# EAGLE design cart_socket (EAGLE 5.06)
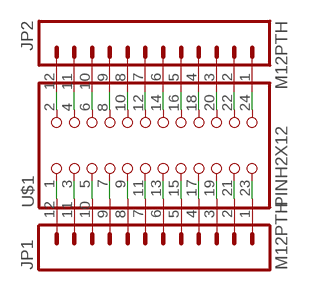
[diagram p0: schematic, sheet 1]

## Parts
JP1  M12PTH  [1X12]
JP2  M12PTH  [1X12]
U$1  PINH2X12  [2X12]

## Nets
N$1: JP1.12 U$1.1
N$2: JP1.11 U$1.3
N$3: JP1.10 U$1.5
N$4: JP1.9 U$1.7
N$5: JP1.8 U$1.9
N$6: JP1.7 U$1.11
N$7: JP1.6 U$1.13
N$8: JP1.5 U$1.15
N$9: JP1.4 U$1.17
N$12: JP1.3 U$1.19
N$14: JP1.2 U$1.21
N$15: JP1.1 U$1.23
N$16: JP2.12 U$1.2
N$17: JP2.11 U$1.4
N$18: JP2.10 U$1.6
N$19: JP2.9 U$1.8
N$20: JP2.8 U$1.10
N$21: JP2.7 U$1.12
N$22: JP2.6 U$1.14
N$23: JP2.5 U$1.16
N$24: JP2.4 U$1.18
N$25: JP2.3 U$1.20
N$26: JP2.2 U$1.22
N$27: JP2.1 U$1.24

## Library data of the parts
JP1 JP2 = SparkFun:M12: Header 12 Standard 12-pin 0.1" header. Use with straight break away headers (SKU : PRT-00116), right angle break away headers (PRT-00553), swiss pins (PRT-00743), machine pins (PRT-00117), and female headers (PRT-00115).
U$1 = SparkFun:PINH2X12

## Board
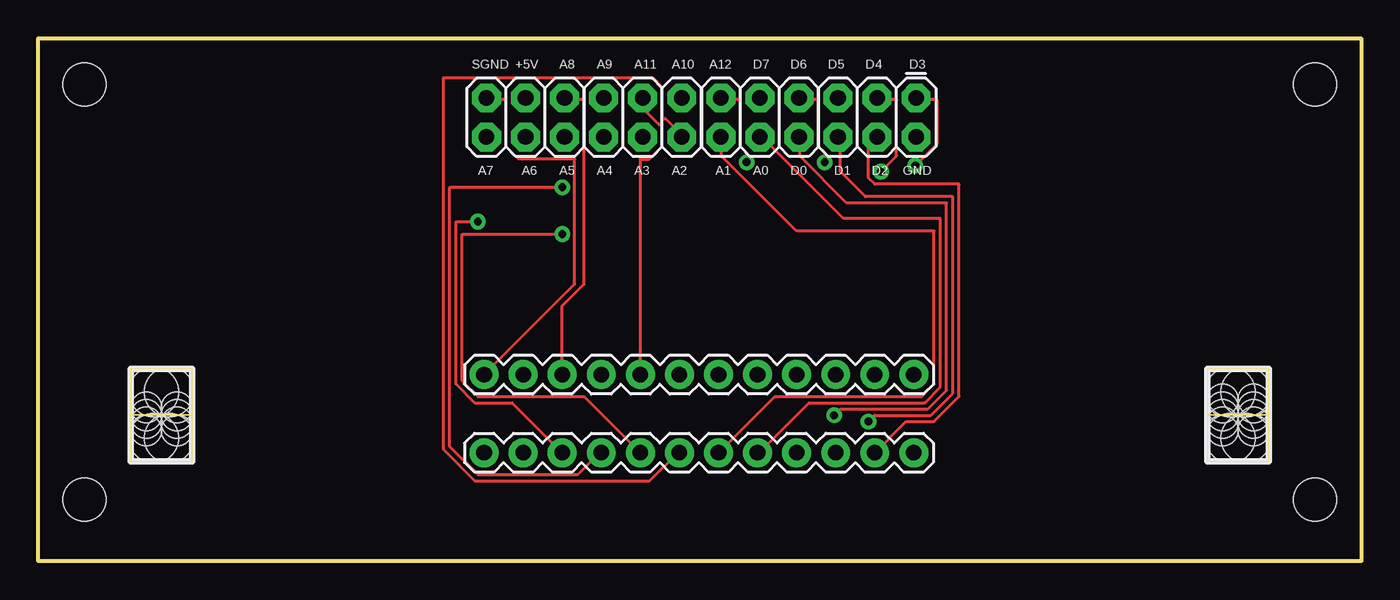
[diagram p1: board, top side]
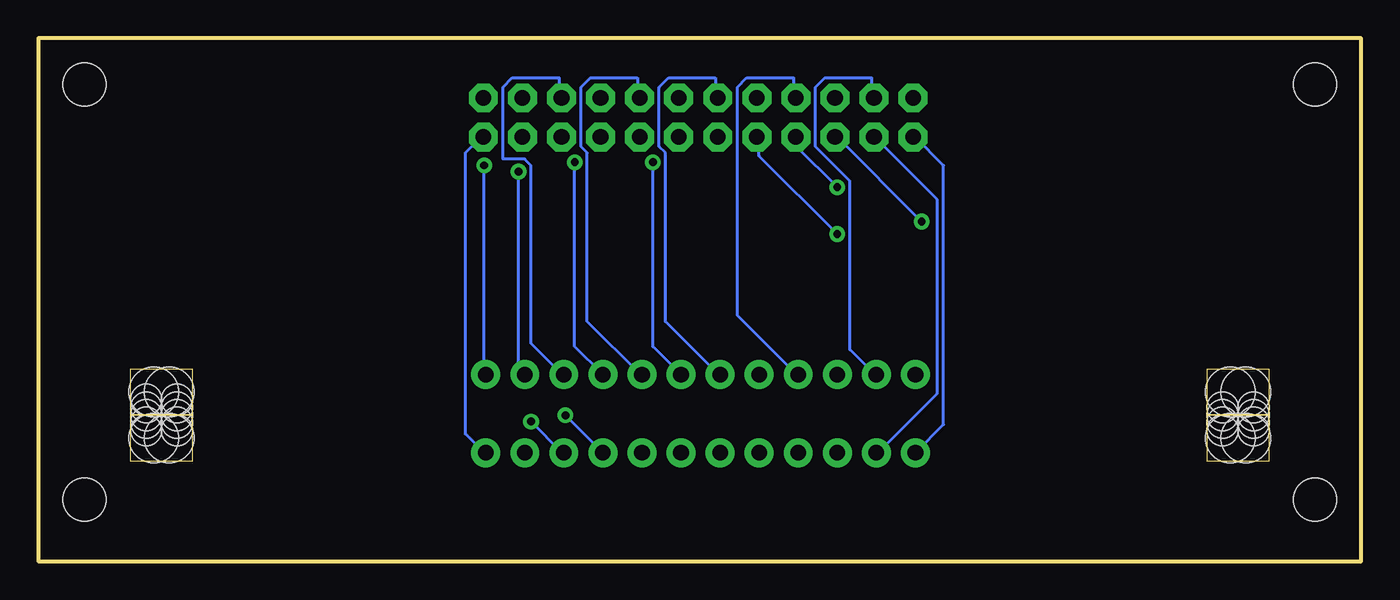
[diagram p2: board, bottom side, seen from below]

Size 86 x 34 mm. Coordinates in mm from the lower left corner, seen from the top.
Outline: 0,0 0,34 86,34 86,0 0,0
Copper layers (1*16): Top 0.035mm / dielectric 1.5mm / Bottom 0.035mm
Design rules "SparkFun": minimum track width 8mil, minimum drill 20mil, track to track 8mil, track to pad 8mil, pad to pad 8mil, via to via 8mil, smd to smd 8mil, copper to edge 10mil, drill to drill 8mil, minimum pad ring 12mil, minimum via ring 10mil, stop-mask expansion 4mil, vias tented up to drill 25mil, thermal gap 10mil
Holes 3.2 mm at 7.5,11 7.5,8 78.5,11 78.5,8 77.5,8 77.5,11 8.5,11 8.5,8
Holes 2 mm at 7,10 7,9 7,8.5 7,9.5 9,10 9,9.5 9,9 9,8.5 77,10.5 77,10 77,9.5 77,9 77,8.5 79,10.5 79,10 79,9.5 79,9 79,8.5
Holes 2.8 mm at 3,31 83,31 3,4 83,4
Milling: area 6,6.5 to 10,9.5; area 6,9.5 to 10,12.5; area 76,9.5 to 80,12.5; area 76,6.5 to 80,9.5

### Footprints (pad centres in the part's own frame; a part is rotated, then mirrored left to right if it is on the bottom)
1X12 = drill 1.016 pad 1.88 round: 1 0,0; 2 2.54,0; 3 5.08,0; 4 7.62,0; 5 10.16,0; 6 12.7,0; 7 15.24,0; 8 17.78,0; 9 20.32,0; 10 22.86,0; 11 25.4,0; 12 27.94,0
2X12 = drill 1.016 pad 1.88 octagon: 1 -13.97,-1.27; 2 -13.97,1.27; 3 -11.43,-1.27; 4 -11.43,1.27; 5 -8.89,-1.27; 6 -8.89,1.27; 7 -6.35,-1.27; 8 -6.35,1.27; 9 -3.81,-1.27; 10 -3.81,1.27; 11 -1.27,-1.27; 12 -1.27,1.27; 13 1.27,-1.27; 14 1.27,1.27; 15 3.81,-1.27; 16 3.81,1.27; 17 6.35,-1.27; 18 6.35,1.27; 19 8.89,-1.27; 20 8.89,1.27; 21 11.43,-1.27; 22 11.43,1.27; 23 13.97,-1.27; 24 13.97,1.27

### Placement (x,y rotation side)
JP1  28.98,12.13 0 top
JP2  28.98,7.05 0 top
U$1  43.1,28.86 180 top

### Tracks (layer width: path | path; a pad name or v marks a point on that pad's centre or on a via)
N$1  (via drill 0.51)
  Top 0.203: v57.02,25.74 58.44,27.16 58.44,30.01 57.22,30.01 U$1.1
  Bottom 0.203: v57.02,25.74 57.02,12.13 JP1.12
N$2  (via drill 0.51)
  Top 0.203: v54.78,25.34 55.8,26.35 55.8,30.01 54.58,30.01 U$1.3
  Bottom 0.203: JP1.11 54.78,12.53 v54.78,25.34
N$3
  Bottom 0.203: JP1.10 51.94,12.13 53.97,14.16 53.97,25.74 54.38,26.15 55.8,26.15 55.8,30.82 55.19,31.43 52.14,31.43 52.14,30.21 U$1.5
N$4  (via drill 0.51)
  Top 0.203: v51.13,25.95 51.13,26.55 50.72,26.96 50.72,30.01 49.5,30.01 U$1.7
  Bottom 0.203: JP1.9 51.13,13.96 v51.13,25.95
N$5
  Bottom 0.203: JP1.8 46.86,12.13 50.31,15.58 50.31,26.55 50.72,26.96 50.72,30.82 50.11,31.43 47.06,31.43 47.06,30.21 U$1.9
N$6  (via drill 0.51)
  Top 0.203: v46.05,25.95 46.05,26.55 45.64,26.96 45.64,30.01 44.42,30.01 U$1.11
  Bottom 0.203: JP1.7 46.05,13.96 v46.05,25.95
N$7
  Bottom 0.203: JP1.6 41.78,12.13 45.23,15.58 45.23,26.55 45.64,26.96 45.64,30.82 45.03,31.43 41.98,31.43 41.98,30.21 U$1.13
N$8
  Top 0.203: JP1.5 39.14,26.15 39.75,26.15 40.56,26.96 40.56,28.38 40.36,28.38 39.34,29.4 39.34,30.01 U$1.15
N$9
  Bottom 0.203: JP1.4 36.7,12.13 40.56,15.99 40.56,30.82 39.95,31.43 36.9,31.43 36.9,30.21 U$1.17
N$10
  Top 0.254: 49.5,6.85 49.3,6.85
N$11
  Top 0.254: 51.94,6.85 51.74,6.85
N$12
  Top 0.203: JP1.3 34.06,16.6 35.48,18.02 35.48,30.01 34.26,30.01 U$1.19
N$13
  Top 0.254: 56.82,6.85 57.02,6.85
N$14
  Bottom 0.203: JP1.2 31.62,12.13 33.25,13.75 33.25,24.73 35.48,26.96 35.48,30.82 34.87,31.43 31.82,31.43 31.82,30.21 U$1.21
N$15
  Top 0.203: JP1.1 34.87,18.02 34.87,26.15 31.21,26.15 30.4,26.96 30.4,30.01 29.18,30.01 U$1.23
N$16
  Bottom 0.203: JP2.12 57.02,7.05 58.24,8.27 58.24,26.55 57.22,27.57 U$1.2
N$17
  Top 0.203: JP2.11 56.41,9.08 58.24,9.08 59.86,10.71 59.86,24.52 54.38,24.52 53.97,24.93 53.97,27.57 54.38,27.57 U$1.4
N$18  (via drill 0.51)
  Top 0.203: v53.97,9.08 54.38,9.49 58.03,9.49 59.46,10.91 59.46,23.71 53.77,23.71 52.14,25.34 52.14,27.57 U$1.6
  Bottom 0.203: v53.97,9.08 51.94,7.05 JP2.10
N$19  (via drill 0.51)
  Top 0.203: v51.74,9.49 52.14,9.89 57.83,9.89 59.05,11.11 59.05,23.3 52.55,23.3 49.5,26.35 49.5,27.57 U$1.8
  Bottom 0.203: JP2.9 v51.74,9.49
N$20
  Top 0.203: JP2.8 46.86,7.05 50.11,10.3 57.63,10.3 58.65,11.32 58.65,22.29 52.35,22.29 47.06,27.57 U$1.10
N$21
  Top 0.203: JP2.7 47.88,10.71 57.43,10.71 58.24,11.52 58.24,21.48 49.3,21.48 44.42,26.35 44.42,27.57 U$1.12
N$22
  Top 0.203: JP2.6 41.58,7.05 39.75,5.22 28.37,5.22 26.34,7.25 26.34,31.43 39.95,31.43 40.56,30.82 40.56,28.79 40.76,28.79 41.78,27.77 U$1.14
N$23  (via drill 0.51)
  Top 0.203: JP2.5 35.48,10.71 28.57,10.71 27.55,11.72 27.55,21.27 v34.06,21.27
  Bottom 0.203: v34.06,21.27 39.14,26.35 39.14,27.57 U$1.16
N$24  (via drill 0.51)
  Top 0.203: v34.06,24.32 26.74,24.32 26.74,7.45 28.57,5.63 35.07,5.63 36.5,7.05 JP2.4
  Bottom 0.203: v34.06,24.32 36.7,26.96 36.7,27.57 U$1.18
N$25  (via drill 0.51)
  Top 0.203: JP2.3 30.81,10.3 28.37,10.3 27.15,11.52 27.15,22.09 v28.57,22.09
  Bottom 0.203: v28.57,22.09 34.06,27.57 U$1.20
N$26
  Bottom 0.203: JP2.2 31.42,7.05 27.55,10.91 27.55,23.51 31.62,27.57 U$1.22
N$27
  Bottom 0.203: JP2.1 27.15,8.88 27.15,25.74 28.98,27.57 U$1.24

### Text on the board
tPlace: SGND | +5V | A8 | A9 | A11 | A10 | A12 | D7 | D6 | D5 | D4 | D3 | A7 | A6 | A5 | A4 | A3 | A2 | A1 | A0 | D0 | D1 | D2 | GND